# EasyEDA Pro project ProPrj_STM32音响_2025-06-08.epro, board Second Test
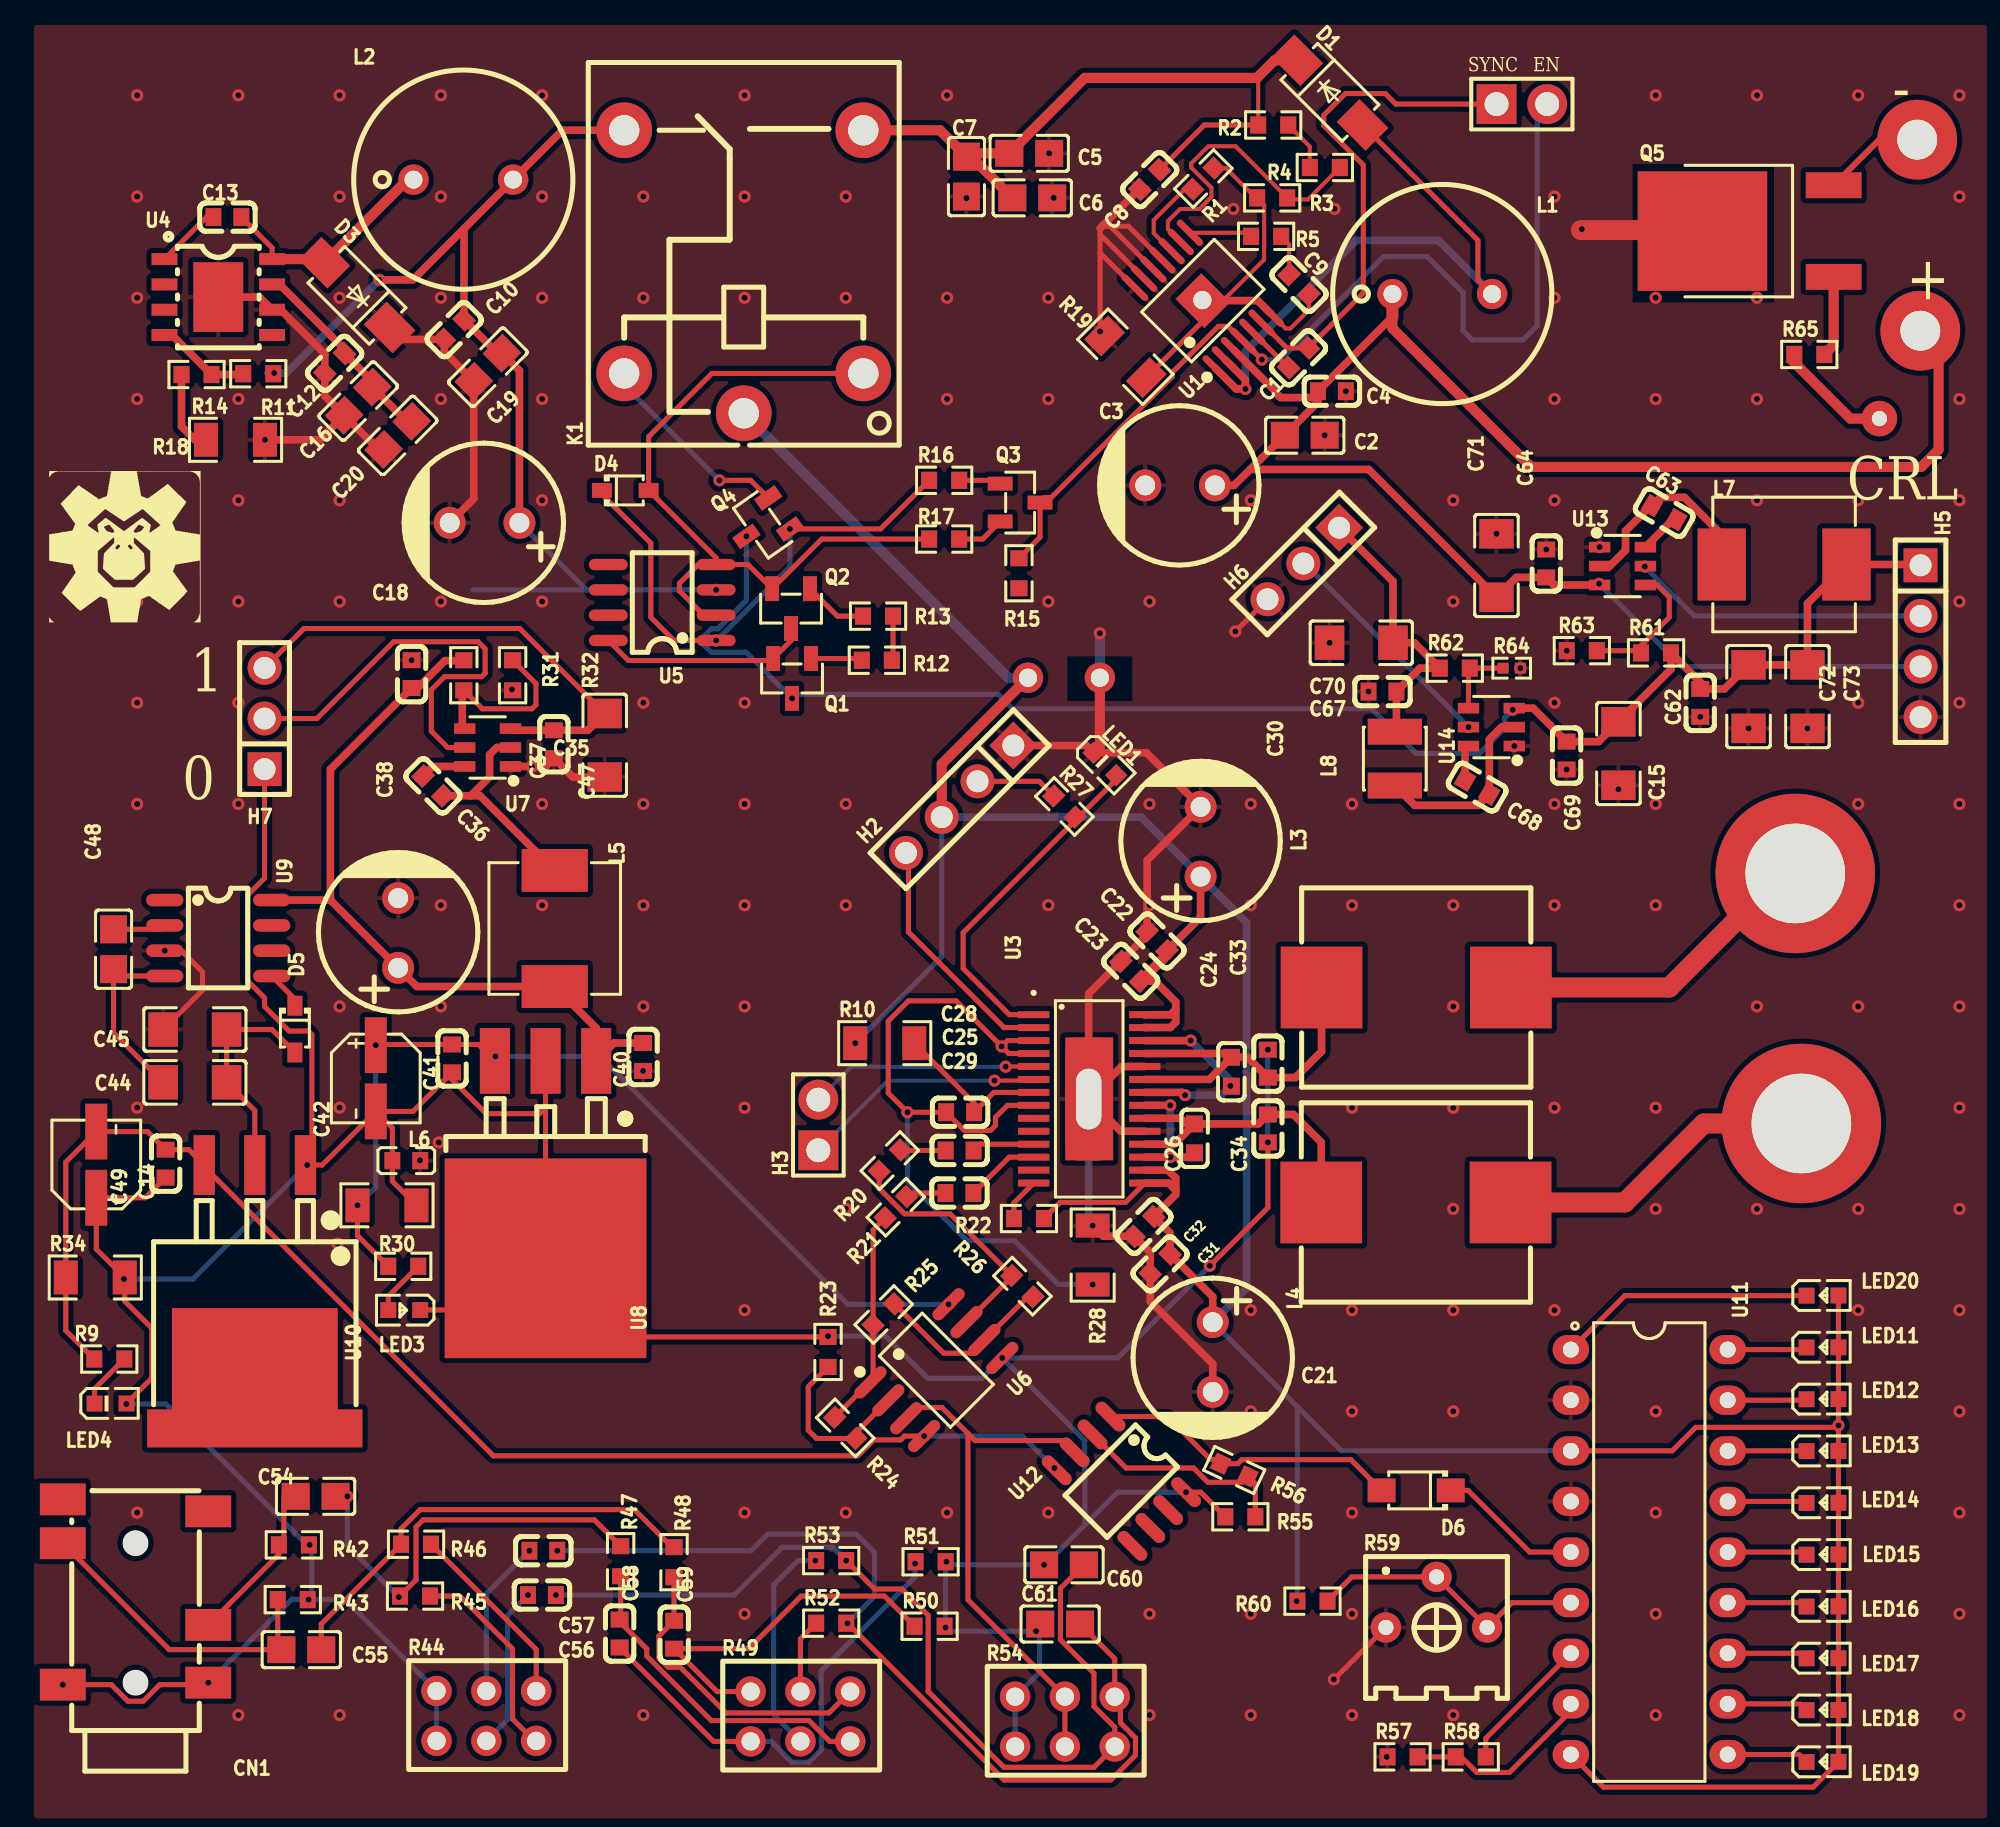
[diagram p17: board, top side]
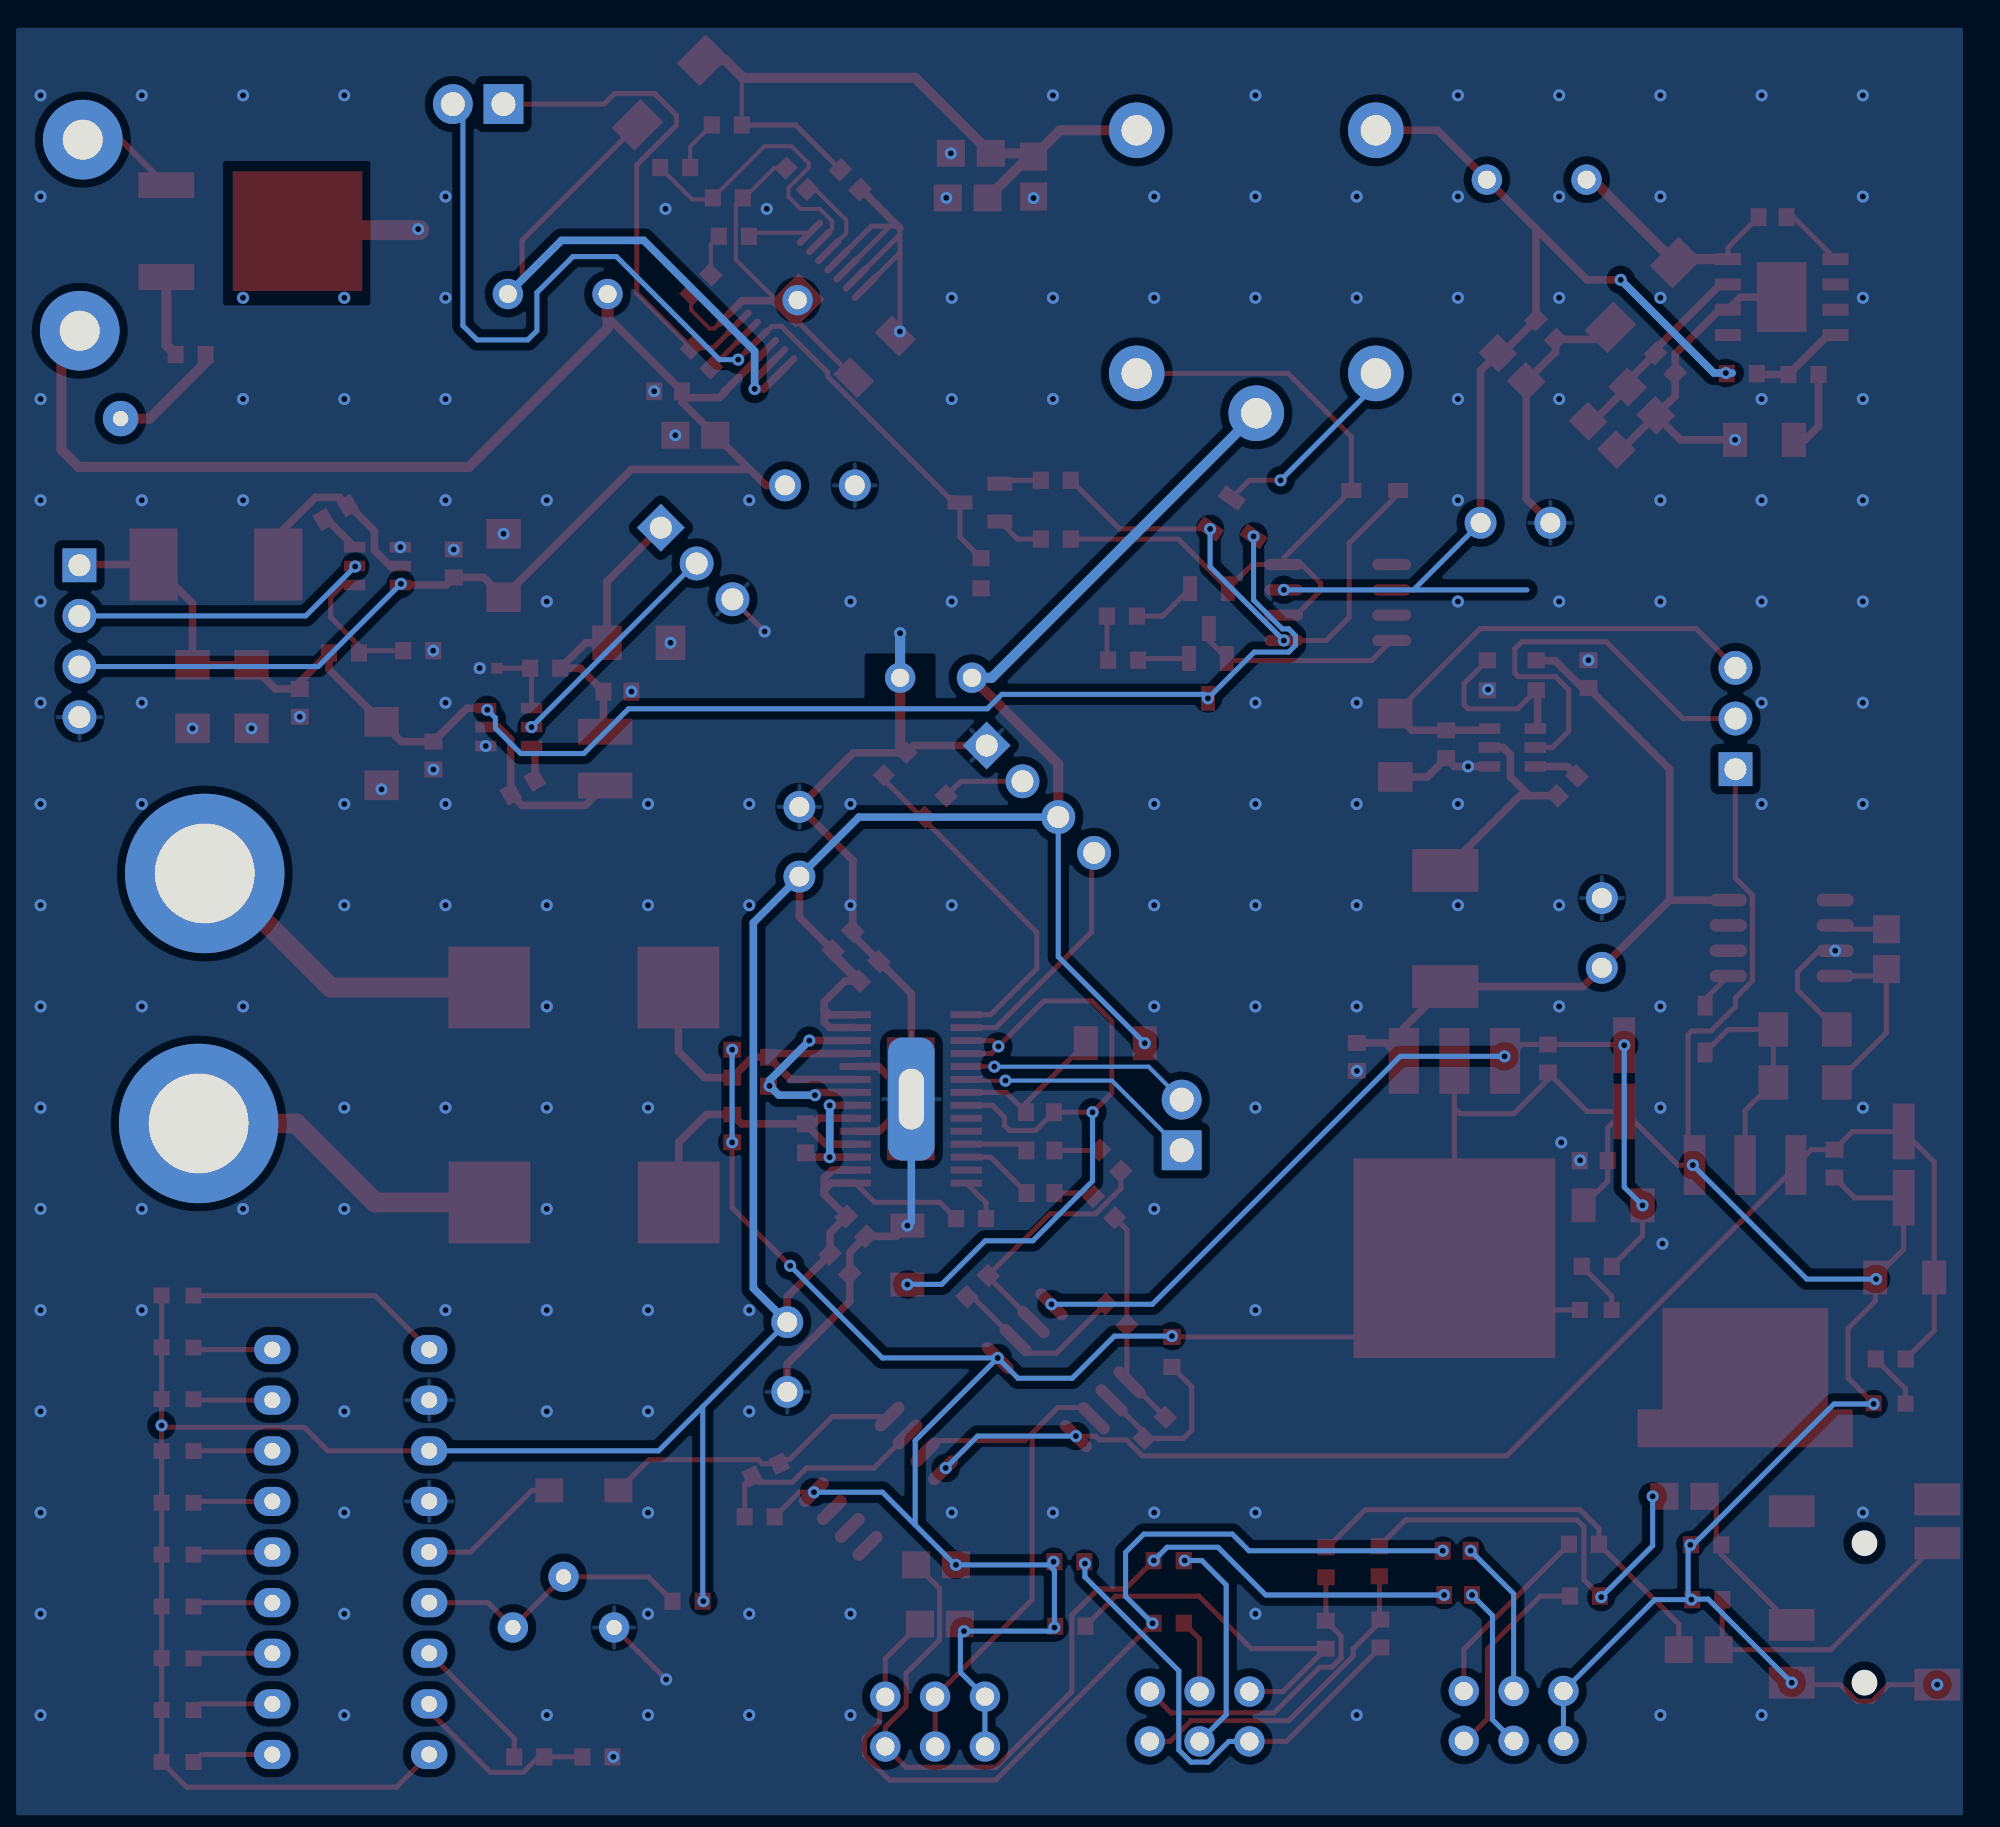
[diagram p18: board, bottom side, seen from below]

Outline 1.29 x 8.29 mm; copper layers: Top Layer, Bottom Layer. Coordinates in mm from the lower left corner of the outline.
Stack: Top Layer 0.035mm / Dielectric1 1.51mm FR4 er 4.5 / Bottom Layer 0.035mm

## Design rules (mm)
template: JLCPCB Capability(Two Layers Board)
spacing copperThickness1oz (default): track to track 0.102, other pairs 0.152 to 0.3
spacing copperThickness2oz: track to track 0.203, other pairs 0.152 to 0.3
track width copperThickness1oz (default): min 0.127, default 0.254, max 2.54
track width copperThickness2oz: min 0.203, default 0.254, max 2.54
differential pair differentialPair (default): width min 0.127, default 0.254, max 2.54; gap min 0.152, default 0.152
via viaSize (default): diameter min 0.5, default 0.61, max 10; hole min 0.3, default 0.305, max 6.3

## Placement (name value [footprint] x y rotation side)
C1  100nF  [C0603]  59 67.13 225 top
C2  10uF  [C0805]  59.32 63.24 180 top
C3  100uF  [CAP-TH_BD8.0-P3.50-D0.6-FD]  53.06 60.73 180 top
C4  100nF  [C0603]  60.68 65.45 180 top
C5  10uF  [C0805]  45.49 77.39 180 top
C6  10uF  [C0805]  45.64 75.16 180 top
C7  10uF  [C0805]  42.34 76.22 90 top
C8  100nF  [C0603]  51.54 76.07 45 top
C9  100nF  [C0603]  59.03 70.81 315 top
C10  10nF  [C0603]  16.64 68.54 225 top
C12  10nF  [C0603]  10.64 66.85 45 top
C13  10nF  [C0603]  5.26 74.19 180 top
C14  470nF  [C0603]  2.16 26.69 270 top
C15  22uF  [C1206]  75.06 47.27 270 top
C16  22uF  [C0805]  11.82 64.96 45 top
C18  100uF  [CAP-TH_BD8.0-P3.50-D0.6-FD]  18.16 58.85 180 top
C19  10uF  [C0805]  18.33 66.66 45 top
C20  22uF  [C0805]  13.8 63.24 45 top
C21  100uF  [CAP-TH_BD8.0-P3.50-D0.6-FD]  54.7 16.99 270 top
C22  100nF  [C0603]  51.91 37.87 135 top
C23  1nF  [C0603]  50.58 36.34 135 top
C24  470nF  [CAP-SMD_L1.6-W0.8-3]  55.64 31.3 270 top
C25  1uF  [C0603]  42.02 29.27 0 top
C26  470nF  [CAP-SMD_L1.6-W0.8-3]  53.79 27.96 270 top
C28  1uF  [C0603]  42 27.35 0 top
C29  1uF  [C0603]  41.99 25.22 0 top
C30  100uF  [CAP-TH_BD8.0-P3.50-D0.6-FD]  54.09 42.85 90 top
C31  100nF  [C0603]  52.06 21.66 225 top
C32  1nF  [C0603]  51.25 23.54 225 top
C33  1uF  [C0603]  57.47 31.71 270 top
C34  1uF  [C0603]  57.47 28.46 270 top
C35  10nF  [C0603]  14.5 51.26 270 top
C36  10nF  [C0603]  15.57 45.65 135 top
C37  10nF  [C0603]  21.64 47.74 90 top
C38  100uF  [CAP-TH_BD8.0-P3.50-D0.6-FD]  13.83 38.27 90 top
C40  470nF  [C0603]  26.12 32.05 90 top
C41  470nF  [C0603]  16.53 31.97 90 top
C42  10uF  [CAP-SMD_BD4.0-L4.3-W4.3-LS5.0-FD]  12.7 30.98 270 top
C44  10uF  [C1206]  3.63 30.77 180 top
C45  10uF  [C1206]  3.63 33.42 0 top
C47  10uF  [C1206]  24.19 47.69 90 top
C48  22uF  [C0805]  -0.45 37.45 90 top
C49  10uF  [CAP-SMD_BD4.0-L4.3-W4.3-LS5.0-FD]  -1.32 26.64 90 top
C54  2.2uF  [C0805]  9.68 10 180 top
C55  2.2uF  [C0805]  8.97 2.3 0 top
C56  10nF  [C0603]  21.04 5.05 0 top
C57  10nF  [C0603]  21.11 7.27 0 top
C58  10nF  [C0603]  24.94 3.11 270 top
C59  10nF  [C0603]  27.68 3.05 270 top
C60  470pF  [C0805]  47.24 6.56 180 top
C61  470pF  [C0805]  47.04 3.59 0 top
C62  10nF  [C0603]  79.16 49.81 90 top
C63  10nF  [C0603]  77.35 59.36 330 top
C64  10nF  [C0603]  71.44 56.81 270 top
C67  10nF  [C0603]  63.22 50.38 0 top
C68  10nF  [C0603]  67.97 45.59 150 top
C69  10nF  [C0603]  72.46 47.17 90 top
C70  22uF  [C1206]  62.15 52.83 180 top
C71  22uF  [C1206]  68.94 56.71 90 top
C72  22uF  [C1206]  81.58 50.13 270 top
C73  22uF  [C1206]  84.54 50.13 270 top
CN1  PJ-342  [AUDIO-SMD_PJ-342]  0.65 5.2 180 top
D1  SS54  [SMA_L4.3-W2.6-LS5.0-FD]  60.58 80.44 135 top
D3  SS54  [SMA_L4.3-W2.6-LS5.0-FD]  11.76 70.28 315 top
D4  1N5819WS  [SOD-323_L1.8-W1.3-LS2.5-RD]  25.22 60.47 0 top
D5  1N5819WS  [SOD-323_L1.8-W1.3-LS2.5-RD]  8.64 33.44 270 top
D6  1N4007W  [SOD-123FL_L2.7-W1.8-LS3.8-RD]  64.91 10.3 180 top
H2  PZ254V-11-04P  [HDR-TH_4P-P2.54-V-M]  42 44.98 225 top
H3  PZ254V-11-02P  [HDR-TH_2P-P2.54-V-M]  34.91 28.63 90 top
H4  PZ254V-11-02P  [HDR-TH_2P-P2.54-V-M]  70.21 79.86 0 top
H5  PZ254V-11-04P  [HDR-TH_4P-P2.54-V-M]  90.22 52.91 270 top
H6  PZ254V-11-03P  [HDR-TH_3P-P2.54-V-M]  59.25 56.81 225 top
H7  PZ254V-11-03P  [HDR-TH_3P-P2.54-V-M]  7.12 49.03 90 top
K1  SRD-05VDC-SL-C  [RELAY-TH_SRD-XXVDC-XL-C]  31.17 71.45 90 top
L1  YDPK0912-470K  [IND-TH_BD11.0-P5.00-D0.6]  66.22 70.33 0 top
L2  YDPK0912-470K  [IND-TH_BD11.0-P5.00-D0.6]  17.09 76.07 0 top
L3  15uH  [IND-SMD_L11.5-W10.0_FXL1040]  64.91 35.53 0 top
L4  15uH  [IND-SMD_L11.5-W10.0_FXL1040]  64.89 24.74 0 top
L5  22uH  [IND-SMD_L7.1-W6.6]  21.68 38.49 270 top
L6  BLM18AG601SN1D  [L0603]  14.23 26.84 0 top
L7  15uH  [IND-SMD_L7.0-W6.6_FXL0630]  83.37 56.76 180 top
L8  2.2uH  [IND-SMD_L3.0-W3.0_FNR30XXS]  63.84 47.02 270 top
LED1  XL-1608UGC-04  [LED0603-RD_GREEN]  49.29 46.75 315 top
LED3  XL-1608SURC-06  [LED0603-RD_RED]  14.13 19.35 180 top
LED4  XL-1608UGC-04  [LED0603-RD_GREEN]  -0.61 14.66 0 top
LED11  XL-1608SURC-06  [LED0603-RD_RED]  85.3 17.47 0 top
LED12  XL-1608SURC-06  [LED0603-RD_RED]  85.3 14.87 0 top
LED13  XL-1608SURC-06  [LED0603-RD_RED]  85.3 12.27 0 top
LED14  XL-1608SURC-06  [LED0603-RD_RED]  85.3 9.67 0 top
LED15  XL-1608SURC-06  [LED0603-RD_RED]  85.3 7.07 0 top
LED16  XL-1608SURC-06  [LED0603-RD_RED]  85.3 4.47 0 top
LED17  XL-1608SURC-06  [LED0603-RD_RED]  85.3 1.87 0 top
LED18  XL-1608SURC-06  [LED0603-RD_RED]  85.3 -0.73 0 top
LED19  XL-1608SURC-06  [LED0603-RD_RED]  85.3 -3.33 0 top
LED20  XL-1608SURC-06  [LED0603-RD_RED]  85.3 20.07 0 top
NOREF  -  [Pad_e339]  45.43 51.08 0 top
NOREF#2  -  [Pad_e138]  54.18 70.03 0 top
NOREF#3  -  [Pad_e517]  48.47 29.93 0 top
NOREF#4  -  [Pad_e850]  84.24 28.71 45 top
NOREF#5  -  [Pad_e1679]  88.15 64.08 45 top
NOREF#6  -  [Pad_e1580]  90.05 78.08 45 top
NOREF#7  -  [Pad_e340]  49.04 51.08 0 top
NOREF#8  -  [Pad_e1648]  90.2 68.49 45 top
NOREF#9  -  [Pad_e845]  83.93 41.25 45 top
Q1  MMBT3904  [SOT-23-3_L2.9-W1.3-P1.90-LS2.4-BR]  33.59 51.04 90 top
Q2  MMBT3906LT1G  [SOT-23-3_L2.9-W1.3-P1.90-LS2.4-BR]  33.54 54.55 90 top
Q3  2N7002KT1G  [SOT-23-3_L2.9-W1.3-P1.90-LS2.4-BR]  45.03 59.87 180 top
Q4  2N7002KT1G  [SOT-23-3_L2.9-W1.3-P1.90-LS2.4-BR]  32.12 58.75 35 top
Q5  AOD240  [TO-252-2_L6.6-W6.1-P4.60-LS10.0-BR-CW]  82.56 73.49 0 top
R1  100kΩ  [R0603]  54.23 76.12 45 top
R2  6.8kΩ  [R0603]  57.73 78.81 180 top
R3  10kΩ  [R0603]  57.68 75.16 180 top
R4  130kΩ  [R0603]  60.33 76.68 180 top
R5  2kΩ  [R0603]  57.38 73.23 0 top
R9  150Ω  [R0603]  -0.67 16.89 0 top
R10  10Ω  [R1206]  38.24 32.74 0 top
R11  10kΩ  [R0603]  6.81 66.33 0 top
R12  1kΩ  [R0603]  37.85 51.95 180 top
R13  1kΩ  [R0603]  37.91 54.17 180 top
R14  750Ω  [R0603]  3.71 66.29 180 top
R15  100kΩ  [R0603]  44.97 56.32 90 top
R16  100Ω  [R0603]  41.22 60.98 0 top
R17  2kΩ  [R0603]  41.22 58.03 180 top
R18  0Ω  [R1206]  5.66 63.01 180 top
R19  0Ω  [R1206]  50.32 67.18 315 top
R20  1kΩ  [R0603]  38.49 26.84 45 top
R21  1kΩ  [R0603]  38.8 24.51 45 top
R22  10kΩ  [R0603]  45.48 23.94 180 top
R23  1kΩ  [R0603]  35.4 17.24 270 top
R24  1kΩ  [R0603]  36.26 13.43 135 top
R25  1kΩ  [R0603]  38.19 19.12 45 top
R26  1kΩ  [R0603]  45.15 20.55 135 top
R27  1kΩ  [R0603]  47.26 44.61 315 top
R28  0Ω  [R1206]  48.67 22.1 270 top
R30  150Ω  [R0603]  14.08 21.54 0 top
R31  10kΩ  [R0603]  17.12 51.2 90 top
R32  750Ω  [R0603]  19.57 51.2 270 top
R33  0Ω  [R1206]  13.26 24.6 0 top
R34  0Ω  [R1206]  -1.37 20.98 0 top
R42  4.7kΩ  [R0603]  8.59 7.56 0 top
R43  4.7kΩ  [R0603]  8.54 4.81 0 top
R44  -  [DIP-6 For RK09L]  18.29 -1.04 0 top
R45  4.7kΩ  [R0603]  14.67 4.99 0 top
R46  4.7kΩ  [R0603]  14.72 7.59 0 top
R47  2kΩ  [R0603]  24.99 6.74 270 top
R48  2kΩ  [R0603]  27.67 6.69 270 top
R49  -  [DIP-6 For RK09L]  34.05 -1.07 0 top
R50  10kΩ  [R0603]  40.49 3.48 0 top
R51  10kΩ  [R0603]  40.54 6.72 0 top
R52  10kΩ  [R0603]  35.55 3.63 0 top
R53  10kΩ  [R0603]  35.55 6.77 0 top
R54  -  [DIP-6 For RK09L]  47.32 -1.33 0 top
R55  1kΩ  [R0603]  56.08 8.97 0 top
R56  10kΩ  [R0603]  55.78 11.32 155 top
R57  1kΩ  [R0603]  64.22 -3.08 0 top
R58  1kΩ  [R0603]  67.65 -3.08 0 top
R59  10kΩ  [RES-ADJ-TH_3362P]  65.93 4.69 0 top
R60  100kΩ  [R0603]  59.71 4.74 0 top
R61  100kΩ  [R0603]  76.94 52.32 0 top
R62  100kΩ  [R0603]  66.85 51.56 0 top
R63  13kΩ  [R0603]  73.22 52.43 180 top
R64  450kΩ  [R0402]  69.7 51.56 0 top
R65  1kΩ  [R0603]  84.64 67.3 0 top
U1  TPS55340PWPR  [HTSSOP-14_L5.0-W4.4-P0.65-LS6.4-BL-EP]  54.2 70 45 top
U3  TPA3110D2PWPR  [TSSOP-28_L9.7-W4.4-P0.65-LS6.4-BL-EP6.2]  48.5 29.94 270 top
U4  TPS5450DDAR  [ESOP-8_L4.9-W3.9-P1.27-LS6.0-TL-EP]  4.8 70.18 0 top
U5  LM358G-S08-R  [SOIC-8_L5.0-W4.0-P1.27-LS6.0-BL]  27.08 54.85 90 top
U6  NE5532DR  [SOIC-8_L4.9-W3.9-P1.27-LS6.0-BL]  40.83 16.33 315 top
U7  TPS54302DDCR  [SOT-23-6_L2.9-W1.6-P0.95-LS2.8-BL]  18.31 47.57 90 top
U8  LM7805S/TR  [TO-263-3_L8.6-W10.2-P2.54-LS14.4-BR]  21.22 26.9 90 top
U9  ICL7660M/TR  [SOP-8_L4.9-W3.9-P1.27-LS6.0-BL]  4.8 38.01 270 top
U10  LM7905S/TR  [TO-263-3L_L10.2-W8.6-P2.54-LS14.4-TL]  6.63 21.29 270 top
U11  LM3916N  [PDIP-18_L22.9-W6.4-P2.54-LS7.9-BL]  76.61 7.2 270 top
U12  NE5532M/TR  [SOP-8_L4.9-W3.9-P1.27-LS6.0-BL]  50.12 10.76 225 top
U13  TPS54302DDCR  [SOT-23-6_L2.9-W1.6-P0.95-LS2.8-BL]  75.26 56.68 270 top
U14  TPS54302DDCR  [SOT-23-6_L2.9-W1.6-P0.95-LS2.8-BL]  68.68 48.6 90 top

## Footprints (pads in the part's own frame, mm; a bottom-side part is the same pattern mirrored in y, then rotated)
AUDIO-SMD_PJ-342
  rect 2.3x1.6 smd: 2(-3.65,4.55) 3(3.65,4.65) 4(-3.65,1.65) 5(3.65,-2.45) 6(-3.65,-4.05) 7(3.65,-4.65)
C0603
  rect 0.8x0.9 smd: 1(-0.7,0) 2(0.7,0)
C0805
  rect 1.41x1.35 smd: 1(-1,0) 2(1,0)
C1206
  rect 1.485x1.728 smd: 1(-1.593,0) 2(1.593,0)
CAP-SMD_BD4.0-L4.3-W4.3-LS5.0-FD
  rect 2.8x1.1 smd: 1(-1.661,0) 2(1.661,0)
CAP-SMD_L1.6-W0.8-3
  rect 0.85x0.85 smd: 1(-0.725,0) 2(0.725,0)
CAP-TH_BD8.0-P3.50-D0.6-FD
  round 1.6 hole 1: 1(-1.75,0) 2(1.75,0)
DIP-6 For RK09L
  round 1.524 hole 0.914: 1(-2.54,1.27) 2(-0.04,1.27) 3(2.46,1.27) 4(-2.54,-1.23) 5(-0.04,-1.23) 6(2.46,-1.23)
ESOP-8_L4.9-W3.9-P1.27-LS6.0-TL-EP
  rect 1.3x0.6 smd: 1(-2.7,1.905) 2(-2.7,0.635) 3(-2.7,-0.635) 4(-2.7,-1.905) 5(2.7,-1.905) 6(2.7,-0.635) 7(2.7,0.635) 8(2.7,1.905)
  rect 2.5x3.5 smd: 9(0,0)
HDR-TH_2P-P2.54-V-M
  rect 2x2 hole 1.2: 1(-1.27,0)
  round 2 hole 1.2: 2(1.27,0)
HDR-TH_3P-P2.54-V-M
  rect 1.7x1.7 hole 1.1: 1(-2.54,0)
  round 1.7 hole 1.1: 2(0,0) 3(2.54,0)
HDR-TH_4P-P2.54-V-M
  rect 1.7x1.7 hole 1.1: 1(-3.81,0)
  round 1.7 hole 1.1: 2(-1.27,0) 3(1.27,0) 4(3.81,0)
HTSSOP-14_L5.0-W4.4-P0.65-LS6.4-BL-EP
  oval 0.343x1.732 smd: 1(-1.95,-2.866) 2(-1.3,-2.866) 3(-0.65,-2.866) 4(0,-2.866) 5(0.65,-2.866) 6(1.3,-2.866) 7(1.95,-2.866) 8(1.95,2.865) 9(1.3,2.865) 10(0.65,2.865) 11(0,2.865) 12(-0.65,2.865) 13(-1.3,2.865) 14(-1.95,2.865)
  rect 1.83x2.055 smd: 15(0,0)
IND-SMD_L3.0-W3.0_FNR30XXS
  rect 1.3x2.72 smd: 1(1.35,0) 2(-1.35,0)
IND-SMD_L7.0-W6.6_FXL0630
  rect 2.424x3.62 smd: 1(3.128,0) 2(-3.128,0)
IND-SMD_L7.1-W6.6
  rect 2.15x3.32 smd: 1(-2.913,0) 2(2.913,0)
IND-SMD_L11.5-W10.0_FXL1040
  rect 4.1x4.1 smd: 1(-4.75,0) 2(4.75,0)
IND-TH_BD11.0-P5.00-D0.6
  round 1.524 hole 0.9: 1(-2.5,0) 2(2.5,0)
L0603
  rect 0.8x0.864 smd: 1(-0.7,0) 2(0.7,0)
LED0603-RD_GREEN
  rect 0.8x0.8 smd: 1(-0.799,-0.004) 2(0.799,0.004)
LED0603-RD_RED
  rect 0.8x0.8 smd: 1(-0.799,-0.004) 2(0.799,0.004)
Pad_e138
  round 1.524 hole 0.914: 1(0,0)
Pad_e339
  round 1.524 hole 0.914: 1(0,0)
Pad_e340
  round 1.524 hole 0.914: 2(0,0)
Pad_e517
  rrect 2.337x6.17 hole 1.27x3.048: 1(0,0)
Pad_e845
  round 8 hole 5: 1(0,0)
Pad_e850
  round 8 hole 5: 1(0,0)
Pad_e1580
  round 4 hole 2: 1(0,0)
Pad_e1648
  round 4 hole 2: 1(0,0)
Pad_e1679
  round 1.778 hole 0.762: 1(0,0)
PDIP-18_L22.9-W6.4-P2.54-LS7.9-BL
  oval 1.462x1.827 hole 0.8: 1(-10.16,-3.935) 2(-7.62,-3.935) 3(-5.08,-3.935) 4(-2.54,-3.935) 5(0,-3.935) 6(2.54,-3.935) 7(5.08,-3.935) 8(7.62,-3.935) 9(10.16,-3.935) 10(10.16,3.935) 11(7.62,3.935) 12(5.08,3.935) 13(2.54,3.935) 14(0,3.935) 15(-2.54,3.935) 16(-5.08,3.935) 17(-7.62,3.935) 18(-10.16,3.935)
R0402
  rect 0.566x0.54 smd: 1(-0.433,0) 2(0.433,0)
R0603
  rect 0.806x0.864 smd: 1(-0.753,0) 2(0.753,0)
R1206
  rect 1.208x1.701 smd: 1(-1.479,0) 2(1.479,0)
RELAY-TH_SRD-XXVDC-XL-C
  round 2.794 hole 1.524: 1(-5.1,-6) 2(7.1,-6) 3(7.1,6) 4(-5.1,6) 5(-7.1,0)
RES-ADJ-TH_3362P
  round 1.524 hole 0.762: 1(-2.54,-1.27) 2(0,1.27) 3(2.54,-1.27)
SMA_L4.3-W2.6-LS5.0-FD
  rect 2.046x1.62 smd: 1(-2.304,-0.009) 2(2.304,0.009)
SOD-123FL_L2.7-W1.8-LS3.8-RD
  rect 1.4x1.2 smd: 1(-1.735,0) 2(1.735,0)
SOD-323_L1.8-W1.3-LS2.5-RD
  rect 1x0.75 smd: 1(-1.173,0) 2(1.173,0)
SOIC-8_L4.9-W3.9-P1.27-LS6.0-BL
  oval 0.588x2.045 smd: 1(-1.905,-2.772) 2(-0.635,-2.772) 3(0.635,-2.772) 4(1.905,-2.772) 5(1.905,2.772) 6(0.635,2.772) 7(-0.635,2.772) 8(-1.905,2.772)
SOIC-8_L5.0-W4.0-P1.27-LS6.0-BL
  oval 0.569x1.95 smd: 1(-1.905,-2.705) 2(-0.635,-2.705) 3(0.635,-2.705) 4(1.905,-2.705) 5(1.905,2.705) 6(0.635,2.705) 7(-0.635,2.705) 8(-1.905,2.705)
SOP-8_L4.9-W3.9-P1.27-LS6.0-BL
  oval 0.63x1.865 smd: 1(-1.905,-2.683) 2(-0.635,-2.683) 3(0.635,-2.683) 4(1.905,-2.683) 5(1.905,2.683) 6(0.635,2.683) 7(-0.635,2.683) 8(-1.905,2.683)
SOT-23-3_L2.9-W1.3-P1.90-LS2.4-BR
  rect 1.25x0.7 smd: 1(1,-0.95) 2(1,0.95) 3(-1,0)
SOT-23-6_L2.9-W1.6-P0.95-LS2.8-BL
  rect 0.532x1.072 smd: 1(-0.95,-1.149) 2(0,-1.149) 3(0.95,-1.149) 4(0.95,1.149) 5(0,1.149) 6(-0.95,1.149)
TO-252-2_L6.6-W6.1-P4.60-LS10.0-BR-CW
  rect 2.8x1.3 smd: 1(3.292,-2.3) 3(3.292,2.3)
  rect 6.5x6 smd: 2(-3.292,0)
TO-263-3_L8.6-W10.2-P2.54-LS14.4-BR
  rect 3.3x1.511 smd: 1(4.952,-2.54) 2(4.952,0) 3(4.952,2.54)
  rect 10.02x10.122 smd: 4(-4.952,0)
TO-263-3L_L10.2-W8.6-P2.54-LS14.4-TL
  rect 3x1.07 smd: 1(-5.338,2.54) 2(-5.338,0) 3(-5.338,-2.54)
  custom 6.99x10.8 smd: 4(5.338,0)
TSSOP-28_L9.7-W4.4-P0.65-LS6.4-BL-EP6.2
  rect 0.35x1.575 smd: 1(-4.225,-2.788) 2(-3.575,-2.788) 3(-2.925,-2.788) 4(-2.275,-2.788) 5(-1.625,-2.788) 6(-0.975,-2.788) 7(-0.325,-2.788) 8(0.325,-2.788) 9(0.975,-2.788) 10(1.625,-2.788) 11(2.275,-2.788) 12(2.925,-2.788) 13(3.575,-2.788) 14(4.225,-2.788) 15(4.225,2.788) 16(3.575,2.788) 17(2.925,2.788) 18(2.275,2.788) 19(1.625,2.788) 20(0.975,2.788) 21(0.325,2.788) 22(-0.325,2.788) 23(-0.975,2.788) 24(-1.625,2.788) 25(-2.275,2.788) 26(-2.925,2.788) 27(-3.575,2.788) 28(-4.225,2.788)
  rect 6.17x2.4 smd: 29(0,0)

## Nets
As in the schematic, except:
+18V: C21.1 C22.1 C23.1 C30.1 C31.1 C32.1 H2.3 K1.5 LED11.2 LED12.2 LED13.2 LED14.2 LED15.2 LED16.2 LED17.2 LED18.2 LED19.2 LED20.2 NOREF.1 R10.1 R22.1 R60.1 U3.15 U3.16 U3.27 U3.28 U11.3 U11.9
AGND_1: C9.2 NOREF#2.1 R1.2 R3.2 R14.2 R18.2 R19.2 U1.7 U1.15
BAT+: C2.2 C3.1 C4.2 C64.2 C71.1 H5.3 L1.1 NOREF#8.1 U1.3 U13.3
BAT-: NOREF#6.1 Q5.3
EP: C2.1 C3.2 C4.1 C5.1 C6.1 C7.1 C8.1 C10.2 C12.1 C15.2 C16.1 C18.2 C19.1 C20.1 C21.2 C22.2 C23.2 C30.2 C31.2 C32.2 C35.1 C37.1 C38.2 C40.1 C45.1 C47.1 C62.1 C64.1 C67.1 C69.1 C70.2 C71.2 C72.2 C73.2 D3.2 H2.1 H5.4 H6.3 L6.2 LED1.1 NOREF#3.1 NOREF#7.2 Q5.2 R18.1 R19.1 R28.1 R32.2 R57.1 R59.1 R63.2 R64.2 U1.11 U1.12 U1.13 U1.14 U3.19 U3.24 U3.29 U4.6 U4.9 U7.1 U9.3 U11.2 U11.4 U13.1 U14.1
PWM_IN: NOREF#5.1 R65.1
$2N3822: L4.2 NOREF#4.1
$2N3827: L3.2 NOREF#9.1

Pads without a net: CN1 6 7; U3 13; U4 2 3; U5 5 6 7; U9 1 6 7; U10 4; U12 5 6 7

## Via types
v1: diameter 0.61, hole 0.305, Top Layer to Bottom Layer, 248 vias

## Routing (per net, layer and track width the routed paths; a pad name or vN(x,y) marks a point on that pad's centre or on a via; arc(x,y) is an arc through that point)
+3.3V: length 14.5
  Top Layer w0.381: H6.1 63.75,55.9 C70.1 64.82,52.83 R62.1 65.09,51.56 C67.2 63.92,48.45 L8.2
+5V_A: length 79.5
  Top Layer w0.381: H5.1 90.18,56.76 L7.2 84.54,54.8 C73.1 C72.1 80.38,50.51 C62.2 79.16,50.86 R61.2 77.7,51.51 74.06,47.87 C69.2 70.78,49.55 U14.3
  Bottom Layer w0.254: v1(69.75,49.47) 69.34,49.06 69.34,48.55 68.07,47.27 64.91,47.27 62.66,49.52 44.66,49.52 43.93,50.24 33.79,50.24 v1(33.59,50.04) 31.27,52.36 29.54,52.36 29.2,52.7 29.2,53.19 29.54,53.53 29.86,53.53 31.3,54.97 v1(31.3,58.17)
+5V_B: length 46.3
  Top Layer w0.254: v1(11.79,24.6) 11.79,23.08 R30.1 ; v1(12.7,32.64) 12.74,32.67 C41.2 17.86,32.67 U8.3
  Bottom Layer w0.254: v1(41.44,19.64) 36.38,19.64 23.94,32.08 v1(18.71,32.08) ; v1(12.7,32.64) 12.7,25.52 v1(11.79,24.6)
+8.5V: length 38.8
  Top Layer w0.381: 17.04,51.93 16.17,51.93 14.8,50.56 C35.2 10.43,46.48 10.43,39.92 ; 10.43,39.92 U9.8 ; 10.43,39.92 C38.1 14.76,35.58 L5.2 23.76,33.5 U8.1 24.66,32.75 C40.2
+18V: length 193.5
  Top Layer w0.254: U3.15 50.32,24.75 47.04,24.75 R22.1 ; U11.9 74.31,-4.6 84.83,-4.6 LED19.2 LED18.2 LED17.2 LED16.2 LED15.2 LED14.2 LED13.2 v1(86.1,13.56) ; v1(86.1,13.56) LED12.2 LED11.2 LED20.2 ; v1(86.1,13.56) 86,13.46 78.93,13.46 77.76,12.28 U11.3
  Top Layer w0.381: 52.84,25.36 52.84,25.14 C32.1 52.55,23.22 C31.1 54.7,20.01 C21.1 ; 52.84,25.36 52.84,25.97 52.45,26.37 U3.16 ; 52.84,25.36 52.49,25.72 U3.15 ; U3.27 51.3,33.52 52.57,33.52 52.84,33.79 52.84,34.43 ; C23.1 51.8,35.85 52.84,34.81 52.84,34.43 ; C22.1 54.09,39.06 C30.1 ; U3.28 51.3,34.16 52.57,34.16 52.84,34.43
  Top Layer w0.508: NOREF.1 41.1,46.75 41.1,44.08 ; C22.1 52.4,37.17 C23.1
  Bottom Layer w0.254: v1(36.76,32.74) 41.1,37.08 41.1,44.08 ; U11.3 61.16,12.28 58.94,14.5 ; 58.94,14.5 C21.1 ; 58.94,14.5 58.94,4.69
  Bottom Layer w0.381: C21.1 56.4,20.44 56.4,38.79 C30.1 51.1,44.08 41.1,44.08
  Bottom Layer w0.508: NOREF.1 44.44,51.08 K1.5
  vias: v1(58.91,4.74)
+18V_1: length 35.8
  Top Layer w0.203: R2.2 56.98,81.12 56.92,81.18
  Top Layer w0.254: R2.2 54.28,78.81 C8.2
  Top Layer w0.508: K1.2 41.02,78.55 C7.2 ; D1.2 57.81,82.06 56.92,81.18 48.28,81.18 C5.2 42.51,77.39 C7.2 ; C6.2 42.58,77.22 C7.2
+18V_2: length 55.7
  Top Layer w0.381: K1.3 22.07,78.55 L2.2 17.13,73.61 ; 17.13,73.61 14.57,71.04 v1(12.88,71.04) ; 17.13,73.61 C10.1 18.8,67.37 ; C18.1 19.91,66.49 C19.2
  Bottom Layer w0.254: v1(29.78,55.48) 23.28,55.48 ; 23.28,55.48 17.59,55.48 ; 23.28,55.48 C18.1
  Bottom Layer w0.381: v1(12.88,71.04) 8.2,66.37 v1(7.6,66.37) 7.29,66.37
+24V: length 10.1
  Top Layer w0.381: 14.51,63.94 14.25,63.94 C16.2 12.53,65.95 11.13,67.35 11.13,67.55 7.87,70.81 U4.7
-5V: length 68.6
  Top Layer w0.254: v1(40.22,13.02) 39.23,13.02 39.04,12.83 37.69,12.83 36.89,12.03 18.6,12.03 4.09,26.54 U10.3 3.32,27.39 C14.1 1.25,28.3 C49.2 -2.85,26.77 R34.1 -2.85,18.32 R9.1
  Bottom Layer w0.254: v1(40.22,13.02) 45.15,13.02 v1(46.75,11.42)
-8.5V: length 11.3
  Top Layer w0.254: U10.2 6.63,29.36 C44.1 C45.2 7.49,33.42 D5.2
AGND: length 218.5
  Top Layer w0.254: R55.1 54.1,10.21 v1(53.36,10.21) ; v1(54.55,21.57) 57.47,24.48 v1(57.47,27.76) ; 35.4,18 25.17,18 U8.4 ; v1(4.3,0.65) 4.2,0.55 1.86,0.55 1.03,-0.28 0.26,-0.28 -0.57,0.55 v1(-3,0.55) ; C42.2 10.01,26.62 U10.1 9.5,26.94 9.5,33.17 9.32,33.35 8.35,33.35 7.12,34.58 7.12,35.01 6.27,35.86 6.27,40.16 7.12,41.02 H7.1 ; C42.2 14.57,29.31 C41.1 16.53,30.91 18.24,29.2 20.92,29.2 21.22,29.5 ; C42.2 13.53,28.48 13.53,25.81 R33.2 ; C14.2 1.14,24.98 C49.1 -1.32,22.41 R34.2 0.11,19.79 1.47,18.43 1.47,15.94 LED4.2 ; U8.4 18.63,19.35 LED3.1 ; U8.4 21.22,29.5 ; 21.22,29.5 U8.2
  Bottom Layer w0.254: v1(0.19,14.63) 2.18,14.63 9.5,7.31 9.5,5.02 9.32,4.84 8.49,4.84 v1(4.3,0.65) ; 48.28,8.56 48.28,12.8 v1(44.14,16.94) ; 48.28,8.56 46.29,6.57 ; 48.28,8.56 49.92,10.21 v1(53.36,10.21) ; v1(35.4,18.04) 38.28,18.04 40.4,15.92 43.12,15.92 v1(44.14,16.94) ; R54.4 R54.1 46.01,1.17 46.01,3.05 v1(45.83,3.23) 41.47,3.23 v1(41.29,3.41) 41.29,6.27 41.59,6.56 v1(46.24,6.56) ; v1(44.14,16.94) 49.93,16.94 v1(54.55,21.57) ; v1(0.07,20.9) 3.54,20.9 v1(9.26,26.62) ; R44.4 R44.1 11.17,4.81 v1(9.33,4.81) ; v1(57.47,32.41) v1(57.47,27.76)
  vias: v1(9.39,7.56) v1(41.34,6.72)
AGND_1: length 24.5
  Top Layer w0.203: R1.2 55.36,76.65 56.93,75.08 ; C9.2 59.52,69.53 58.6,68.6 58.36,68.6 U1.7 ; R3.2 57.28,74.8 57.28,72.69 57.28,72.68 57.28,72.06 55.22,70
  Top Layer w0.254: 51.36,66.13 54.2,68.98 U1.15
  Top Layer w0.381: U1.7 56.96,70 54.91,70 ; R14.2 2.95,63.69 3.63,63.01 4.19,63.01
AGND_2: length 37.8
  Top Layer w0.254: U3.3 44.4,32.87 v1(44.11,32.57) ; v1(44.11,32.57) 41.82,34.86 39.43,34.86 38.42,33.84 38.42,30.24 v1(39.38,29.27) C25.1 42.24,28.36 43.55,28.36 43.8,28.61 43.8,29.02 44.4,29.62 U3.8 ; v1(44.11,32.57) 44.46,32.22 U3.4
  Bottom Layer w0.254: 48.58,20.64 46.95,20.64 44.77,22.82 42.38,22.82 39.38,25.82 v1(39.38,29.27)
  vias: v1(48.67,20.63)
GND: length 37.1
  Top Layer w0.254: R17.2 35.08,58.03 Q2.2 31.38,56.75 U5.4 ; K1.1 29.57,66.35 26.39,63.17 D4.2 29.78,57.09 U5.4 ; U5.4 28.88,56.75 27.94,55.82 27.94,55.43 29.16,54.21 U5.2
VIN2: length 24.8
  Top Layer w0.254: C47.2 19.92,53.55 9.1,53.55 H7.3
  Top Layer w0.381: C47.2 23.35,48.44 C37.2 19.55,48.44 U7.3
BAT+: length 95.4
  Top Layer w0.381: C4.2 59.98,64.91 C2.2 ; C4.2 63.72,69.19 ; C4.2 59.66,65.13 58.11,65.13 57.84,65.4 57.84,65.45 U1.3 ; U13.3 71.82,55.73 C64.2 69.93,56.11 C71.1 62.53,61.53 56.57,61.53 ; 56.57,61.53 58.32,63.24 ; 56.57,61.53 55.77,60.73 C3.1
  Top Layer w0.508: NOREF#8.1 91.12,67.57 91.12,62.52 90.25,61.65 70.67,61.65 63.72,68.61 63.72,69.19
  Top Layer w0.6: L1.1 63.72,69.19
  Bottom Layer w0.254: H5.3 78.24,51.64 v1(74.09,55.79)
BAT-: length 5.1
  Top Layer w0.3: Q5.3 88.15,78.08 NOREF#6.1
CRL1: length 2.2
  Top Layer w0.254: R12.1 38.66,52.01 R13.1
DIVIDER_L: length 14.3
  Top Layer w0.254: R60.2 61.68,5.96 R59.2 R59.3 69.71,4.66 U11.6
EN1: length 14.9
  Bottom Layer w0.254: H5.2 78.86,54.18 v1(76.38,56.66)
EN2: length 11.7
  Bottom Layer w0.254: H6.2 59.32,56.81 v1(67.53,48.6)
EN3: length 21.2
  Top Layer w0.254: U7.5 16.31,47.57 15.49,48.39 15.49,50.47 16.15,51.13 18.02,51.13 18.19,51.3 18.19,52.53 17.83,52.88 13.6,52.88 9.75,49.03 H7.2
EN_55340: length 49.3
  Top Layer w0.254: v1(57.17,67.04) U1.4 55.98,68.23 55.95,68.23 55.47,68.71 54.98,68.71 52.67,66.4 52.67,66.19 46.6,60.12 46.29,60.12 Q3.3 46.03,58.13 R15.2
  Bottom Layer w0.254: H4.2 70.98,79.36 70.98,68.74 70.26,68.03 67.72,68.03 67.26,68.49 67.26,70.4 65.46,72.21 63.27,72.21 58.1,67.04 v1(57.17,67.04)
EP: length 133.8
  Top Layer w0.254: C45.1 4.01,35.4 4.01,36.31 2.94,37.38 v1(2.12,37.38) ; v1(55.83,53.4) H6.3 ; U1.11 50.47,73.73 49.55,73.73 ; 49.27,68.23 v1(49.05,68.45) 49.05,72.4 ; 49.05,73.32 49.05,72.4 ; 49.05,73.32 49.05,73.63 ; 49.05,73.32 51.26,71.11 ; 49.05,72.4 U1.14 ; 49.55,73.73 49.15,73.73 ; 49.55,73.73 51.72,71.57 ; v1(60.78,0.81) 60.78,0.81 R59.1
  Top Layer w0.381: C47.1 22.58,46.1 C37.1 21.22,46.62 v1(20.54,46.62) U7.1 ; U4.9 6.7,70.18 6.71,70.17 6.87,70.17 U4.6 7.92,69.54 10.14,67.32 10.14,65.22 C16.1 ; U3.29 50.13,31.57 U3.24 ; v1(48.67,23.58) 49.21,23.05 C32.2 51.56,22.23 C31.2 51.56,19.78 54.7,16.65 C21.2 ; H2.1 48.36,47.67 LED1.1 51.38,47.31 C30.2 51.41,41.92 C22.2 51.41,38.16 C23.2 48.47,35.22 NOREF#3.1 50.09,28.32 U3.19 ; 13.4,68.66 14,68.05 C10.2 16.14,67.43 C19.1 17.62,60.06 C18.2 ; C20.1 12.83,62.53 C16.1 ; v1(7.14,63.01) 9.88,63.01 C16.1 ; 49.05,73.63 49.15,73.73 51.01,75.6 51.34,75.6
  Top Layer w0.508: LED1.1 49.04,47.63 NOREF#7.2
  Top Layer w1: Q5.2 79.22,73.54 73.17,73.54
  Bottom Layer w0.381: 48.68,23.58 48.47,23.79 NOREF#3.1
  Bottom Layer w0.508: NOREF#7.2 v1(49.04,53.31)
  vias: v1(0.73,80.3) v1(0.73,75.22) v1(0.73,70.14) v1(0.73,65.06) v1(0.73,59.98) v1(0.73,54.9) v1(0.73,49.82) v1(0.73,44.74) v1(0.73,29.5) v1(0.73,9.18) v1(5.81,80.3) v1(5.81,65.06) v1(5.81,59.98) v1(5.81,54.9) v1(5.81,49.82) v1(5.81,44.74) v1(5.81,-0.98) v1(10.78,22.68) v1(10.89,80.3) v1(10.89,75.22) v1(10.89,70.14) v1(10.89,59.98) v1(10.89,54.9) v1(10.89,34.58) v1(10.89,29.5) v1(10.89,-0.98) v1(14.5,51.96) v1(14.92,26.86) v1(15.86,27.76) v1(15.97,80.3) v1(15.97,75.22) v1(15.97,70.14) v1(15.97,65.06) v1(15.97,54.9) v1(15.97,39.66) v1(15.97,34.58) v1(19.54,50.49) v1(21.05,80.3) v1(21.05,75.22) v1(21.05,70.14) v1(21.05,65.06) v1(21.05,59.98) v1(21.05,54.9) v1(21.05,44.74) v1(21.05,39.66) v1(26.13,75.22) v1(26.13,70.14) v1(26.13,49.82) v1(26.13,44.74) v1(26.13,39.66) v1(26.13,34.58) v1(26.12,31.35) v1(26.13,-0.98) v1(31.21,80.3) v1(31.21,75.22) v1(31.21,70.14) v1(31.21,49.82) v1(31.21,44.74) v1(31.21,39.66) v1(31.21,34.58) v1(31.21,29.5) v1(31.21,19.34) v1(31.21,9.18) v1(31.21,4.1) v1(36.29,75.22) v1(36.29,70.14) v1(36.29,44.74) v1(36.29,39.66) v1(36.29,34.58) v1(36.29,24.42) v1(36.29,9.18) v1(41.37,80.3) v1(41.37,70.14) v1(41.37,65.06) v1(41.37,9.18) v1(42.34,75.15) v1(46.45,70.14) v1(46.45,65.06) v1(46.45,54.9) v1(46.45,39.66) v1(46.45,9.18) v1(46.49,77.39) v1(46.72,75.16) v1(51.53,54.9) v1(51.53,44.74) v1(51.53,39.66) v1(51.53,4.1) v1(51.53,-0.98) v1(55.73,74.6) v1(56.61,59.98) v1(56.61,44.74) v1(56.61,39.66) v1(56.61,19.34) v1(56.61,14.26) v1(56.61,4.1) v1(56.61,-0.98) v1(60.32,63.24) v1(60.56,52.83) v1(60.81,74.6) v1(61.38,65.45) v1(61.69,44.74) v1(61.69,39.66) v1(61.69,29.5) v1(61.69,19.34) v1(61.69,14.26) v1(61.69,9.18) v1(61.69,4.1) v1(61.69,-0.98) v1(62.52,50.38) v1(63.43,-3.08) v1(66.77,59.98) v1(66.77,54.9) v1(66.77,39.66) v1(66.77,34.58) v1(66.77,29.5) v1(66.77,24.42) v1(66.77,19.34) v1(66.77,14.26) v1(66.77,-0.98) v1(68.94,58.3) v1(69.83,47.65) v1(70.13,51.56) v1(71.44,57.51) v1(71.85,75.22) v1(71.85,70.14) v1(71.85,65.06) v1(71.85,59.98) v1(71.85,49.82) v1(71.85,44.74) v1(71.85,39.66) v1(71.85,29.5) v1(71.85,19.34) v1(72.47,52.43) v1(72.46,46.47) v1(73.22,73.59) v1(74.11,57.63) v1(75.06,45.48) v1(76.93,80.3) v1(76.93,70.14) v1(76.93,65.06) v1(76.93,44.74) v1(76.93,39.66) v1(76.93,29.5) v1(76.93,24.42) v1(76.93,14.26) v1(76.93,9.18) v1(76.93,4.1) v1(76.93,-0.98) v1(79.16,49.11) v1(81.58,48.54) v1(82.01,80.3) v1(82.01,70.14) v1(82.01,65.06) v1(82.01,59.98) v1(82.01,34.58) v1(82.01,24.42) v1(84.54,48.54) v1(87.09,80.3) v1(87.09,59.98) v1(87.09,49.82) v1(87.09,44.74) v1(87.09,34.58) v1(87.09,24.42) v1(87.09,19.34) v1(92.17,80.3) v1(92.17,75.22) v1(92.17,65.06) v1(92.17,59.98) v1(92.17,54.9) v1(92.17,49.82) v1(92.17,44.74) v1(92.17,39.66) v1(92.17,34.58) v1(92.17,29.5) v1(92.17,24.42) v1(92.17,19.34) v1(92.17,14.26) v1(92.17,9.18) v1(92.17,4.1) v1(92.17,-0.98)
FAULT#: length 12.3
  Top Layer w0.254: 39.31,42.29 39.43,42.16 39.43,38.31 44.23,33.52 U3.2
GAIN_0: length 11.5
  Top Layer w0.203: v1(44.31,31.56) 44.32,31.57 U3.5
  Bottom Layer w0.203: H3.2 36.57,31.56 v1(44.31,31.56)
GAIN_1: length 12.3
  Top Layer w0.203: v1(43.75,30.86) 45.66,30.86 U3.6
  Bottom Layer w0.203: v1(43.75,30.86) 38.41,30.86 H3.1
IN+: length 11
  Top Layer w0.254: R24.2 37.48,15.72 ; R21.1 37.66,23.37 R25.1 37.66,15.85 37.52,15.72
IN-: length 12.5
  Top Layer w0.254: R26.2 41.52,24.17 39.24,24.17 37.96,25.45 R20.1 ; U6.7 44.62,21.01
INL+_PRE: length 27.3
  Top Layer w0.254: U12.3 47.18,12.8 42.77,12.8 42.42,13.15 ; R54.5 R54.2 42.42,4.81 42.42,13.15 ; 39.32,13.92 39.85,14.45 41.11,14.45 42.42,13.15
L+: length 8
  Top Layer w0.254: 4.3,3.55 7.84,7.09 R42.1 8.09,7.81 8.09,10
PWM_IN: length 5.6
  Top Layer w0.508: NOREF#5.1 86.69,64.08 83.78,66.99
R+: length 15.8
  Top Layer w0.254: CN1.5 2.34,2.3 C55.1 7.78,2.49 R43.1
SD#: length 17.3
  Top Layer w0.254: 49.7,46.12 49.7,45.8 42.18,38.28 42.18,36.49 44.49,34.17 U3.1
SYNC: length 25.9
  Top Layer w0.254: 68.94,79.86 63.89,79.86 63.36,80.39 61.36,80.39 60.27,79.3 60.27,78.79 62.26,76.8 62.26,70.38 C1.1 58.42,67.62 U1.6
VU_L: length 15.4
  Top Layer w0.254: 55.25,11.85 54.58,11.85 52.43,14 U12.1 ; 55.1,11.64 55.96,11.64 56.16,11.84 61.63,11.84 D6.2
$1N1243: length 4.8
  Top Layer w0.203: U1.10 51.74,73.38 51.74,74.04 53.29,75.59 53.95,75.59
$1N1251: length 2.6
  Top Layer w0.254: 56.69,68.43 58.49,66.63 C1.2
$1N1256: length 32.7
  Top Layer w0.254: 62.21,78.82 68.01,73.02 68.01,71.04 L1.2
  Top Layer w0.381: 54.85,66.59 55.88,65.57 v1(56.34,65.57) 56.34,66.03 U1.2
  Bottom Layer w0.381: L1.2 66.03,73.02 61.9,73.02 56.34,67.46 v1(56.34,65.57)
$1N1257: length 2.6
  Top Layer w0.203: R4.2 59.57,77.73 R2.1
$1N1259: length 15.6
  Top Layer w0.203: R3.1 55.85,77.75 54.48,77.75 53.62,76.88 53.62,76.68 54.64,75.66 54.64,75.21 54.03,74.6 53.06,74.6 52.45,73.99 52.45,73.59 U1.9 ; 58.44,75.08 59.47,75.08 R4.1
$1N1260: length 3.1
  Top Layer w0.203: R5.1 56.45,73.4 53.56,73.4
$1N1261: length 2.1
  Top Layer w0.203: C9.1 58.53,72.82 R5.2
$1N1268: length 3.3
  Top Layer w0.254: C13.2 4.21,74.19 U4.1
$1N1269: length 11.6
  Top Layer w0.254: U4.8 7.5,72.65 C13.1
  Top Layer w0.508: L2.1 14.29,76.07 D3.1 9.94,72.08 U4.8
$1N1273: length 4.8
  Top Layer w0.381: R11.1 6.01,66.29 R14.1 2.48,68.27 U4.4
$1N2047: length 10.6
  Top Layer w0.254: U5.8 25.38,51.94 32.54,51.94 Q1.2 33.54,52.94 Q2.3
$1N2049: length 2.4
  Top Layer w0.254: 41.98,58.03 43.15,58.03 Q3.2
$1N2050: length 26.3
  Top Layer w0.254: R16.1 38.03,58.54 v1(33.48,58.54) ; 24.05,60.47 24.05,60.28 26.5,57.83 26.5,54.11 27.67,52.94 v1(29.78,52.94)
  Bottom Layer w0.254: v1(33.48,58.54) 33.48,56.65 v1(29.78,52.94)
$1N2051: length 2.1
  Top Layer w0.254: R16.2 43.87,60.98 Q3.1
$1N2061: length 3.2
  Top Layer w0.254: Q2.1 35.87,54.17 R13.2
$1N2062: length 2.6
  Top Layer w0.254: Q1.1 37.01,52.04 R12.2
$1N4412: length 10.2
  Top Layer w0.254: Q4.2 31.51,60.98 v1(29.95,60.98)
  Bottom Layer w0.254: v1(29.95,60.98) 25.17,65.76 K1.4
$1N7340: length 4.1
  Top Layer w0.508: Q5.1 85.86,67.77 R65.2
$2N1692: length 15.7
  Top Layer w0.381: U3.20 53.1,28.97 53.38,28.69 C26.1 ; L4.1 60.14,27.76 58.75,29.16 C34.1 56.99,28.69 C26.1 ; U3.18 52.77,27.67 C26.1
$2N1693: length 17.9
  Top Layer w0.381: C24.1 56.45,32.03 57.47,31.01 58.85,31.01 60.16,32.32 L3.1 ; C24.1 54.53,30.92 U3.23 ; C24.1 55.45,32.22 U3.25
$2N1694: length 2
  Top Layer w0.254: 39.25,25.22 C29.1
$2N1695: length 3.1
  Top Layer w0.254: C28.2 43.02,27.67 U3.11
$2N1697: length 3.8
  Top Layer w0.254: U3.12 44.49,27.02 C29.2
$2N1698: length 2.2
  Top Layer w0.254: R22.2 44.72,24.73 U3.14
$2N1709: length 10
  Top Layer w0.381: v1(53.31,30.13) 53.17,30.27 U3.22 ; U3.26 v1(53.59,32.87)
  Bottom Layer w0.381: v1(53.59,32.87) 55.59,30.88 v1(55.59,30.59) 55.12,30.13 v1(53.31,30.13)
$2N1714: length 6.5
  Top Layer w0.381: C26.2 53.57,27.02 v1(52.57,27.02) U3.17 ; U3.21 52.57,29.62 v1(52.57,29.62)
  Bottom Layer w0.381: 52.59,27.04 52.57,27.06 v1(52.57,29.62)
$2N1723: length 8.1
  Top Layer w0.254: U3.7 43.72,30.27 C25.2 42.72,29.73 39.72,32.74
$2N1725: length 2
  Top Layer w0.254: C28.1 39.36,27.35 39.32,27.39
$2N3339: length 8.7
  Top Layer w0.254: R23.2 34.4,15.5 34.4,13.32 34.82,12.9 R24.1 36.79,13.19 U6.2
$2N3344: length 9.2
  Top Layer w0.254: R25.2 41.2,17.18 42.58,17.18 U6.6 45.41,20.01 R26.1
$2N3625: length 4.1
  Top Layer w0.254: H2.2 45.99,45.88 46.72,45.15
$2N3822: length 16.2
  Top Layer w1: NOREF#4.1 79.34,28.71 75.38,24.74 L4.2
$2N3827: length 16.6
  Top Layer w1: NOREF#9.1 83.33,41.25 77.61,35.53 L3.2
$3N912: length 8.8
  Top Layer w0.254: 19.57,51.95 20.74,50.78 20.74,49.72 20.54,49.52 18.05,49.52 R31.1
  Top Layer w0.381: R31.1 17.04,50.37 17.04,48.65 U7.4
$3N913: length 10.8
  Top Layer w0.381: 17.47,45.15 C36.1 ; 17.47,45.15 17.94,45.15 L5.1 ; 17.47,45.15 18.42,46.1 18.42,47.22 18.77,47.57 U7.2
$3N916: length 2.3
  Top Layer w0.381: C36.2 15.56,46.62 U7.6
$3N920: length 2.8
  Top Layer w0.254: R30.2 13.33,20.04 LED3.2
$3N1793: length 2.7
  Top Layer w0.254: U9.2 1.92,38.45 C48.2
$3N1802: length 9.4
  Top Layer w0.254: U9.4 -0.11,36.11 C48.1 -0.45,33.26 C44.2
$3N1996: length 2
  Top Layer w0.254: D5.1 8.64,34.95 U9.5
$3N3049: length 2.9
  Top Layer w0.254: R9.2 -1.41,15.4 LED4.1
$5N981: length 10.4
  Top Layer w0.254: 15.43,4.99 16.92,4.99 19.57,2.34 19.57,-1.18 20.66,-2.27 R44.6
$5N1180: length 8.2
  Bottom Layer w0.254: v1(20.34,5.05) 19.31,4.02 19.31,-1.21 R44.5
$5N1185: length 7.9
  Bottom Layer w0.254: v1(20.41,7.27) 18.25,5.11 R44.2
$5N1191: length 21
  Top Layer w0.254: 24.99,7.5 23.67,8.82 15.08,8.82 14.72,8.46 14.72,5.81 v1(13.86,4.94)
  Bottom Layer w0.254: v1(11.28,10) 11.28,7.52 v1(13.86,4.94)
$5N1196: length 22.6
  Top Layer w0.254: R48.1 27.57,7.45 25.69,9.33 14.93,9.33 13.97,8.37 R46.1 9.97,3.59 C55.2
$5N1448: length 15.6
  Top Layer w0.254: R48.2 27.67,3.76 C59.1 26.91,2.99 26.91,1.88 26.95,1.85 26.95,1.84 27.11,1.68 27.12,1.68 27.37,1.42 27.98,1.42 30.28,-0.87 35.44,-0.87 R49.3
$5N1622: length 3.8
  Top Layer w0.254: R52.1 34.01,2.84 R49.2
$5N1741: length 11
  Bottom Layer w0.254: 34.77,6.78 33.9,6.78 32.68,5.55 32.68,-0.96 R49.5
  vias: v1(34.76,6.77)
$5N1768: length 47
  Top Layer w0.254: C60.1 47.06,5.38 47.06,2.8 48.74,1.12 48.74,-0.55 49.78,-1.59 R54.6 48.74,-3.6 44.22,-3.6 40.42,0.21 40.42,4.03 39.1,5.35 37.73,5.35 v1(36.31,6.77)
  Bottom Layer w0.254: v1(21.74,5.05) 30.69,5.05 33.08,7.44 35.64,7.44 v1(36.31,6.77)
$5N2402: length 46.7
  Top Layer w0.254: v1(36.37,3.63) 44.24,-4.24 49.58,-4.24 50.82,-3 50.82,-2.13 50.07,-1.37 50.07,-0.34 R54.3 49.78,1.85 C61.2
  Bottom Layer w0.254: v1(21.81,7.27) 31.53,7.27 32.37,8.1 36.81,8.1 37.72,7.19 37.72,4.98 v1(36.37,3.63)
$5N2454: length 9.6
  Top Layer w0.254: R44.3 20.75,2.32 R46.2
$5N2502: length 18.5
  Top Layer w0.254: R49.1 29.83,0.2 C59.2 31.41,2.35 34.05,4.99 38.22,4.99 R50.1
$5N2537: length 24.1
  Top Layer w0.254: C58.2 29.65,-2.3 R49.4
  Bottom Layer w0.254: R49.4 32.54,-2.3 33.58,-3.34 34.44,-3.34 35.05,-2.73 35.05,1.24 39.76,5.95 v1(39.76,6.62)
$5N2546: length 16.6
  Top Layer w0.254: R47.2 24.99,3.86 C58.1 24.94,3.7 26.3,2.34 26.3,1.98 29.54,-1.26 34.44,-1.26 35.48,-2.3 R49.6
$6N885: length 12.8
  Top Layer w0.254: 84.34,20.07 75.38,20.07 U11.1
$6N891: length 3.8
  Top Layer w0.254: U11.15 84.27,9.74 ; 84.42,9.74 LED14.1
$6N892: length 3.9
  Top Layer w0.254: U11.14 84.21,7.2 ; 84.36,7.2 LED15.1
$6N893: length 3.8
  Top Layer w0.254: U11.17 84.3,14.82 ; 84.45,14.82 LED12.1
$6N894: length 3.8
  Top Layer w0.254: U11.16 84.33,12.28 ; 84.48,12.28 LED13.1
$6N895: length 3.8
  Top Layer w0.254: 84.39,17.36 LED11.1 ; U11.18 84.24,17.36
$6N896: length 3.9
  Top Layer w0.254: U11.13 84.15,4.66 ; 84.3,4.66 LED16.1
$6N897: length 3.9
  Top Layer w0.254: 84.24,2.12 LED17.1 ; U11.12 84.09,2.12
$6N898: length 4
  Top Layer w0.254: U11.10 83.97,-2.96 ; 84.12,-2.96 LED19.1
$6N899: length 3.9
  Top Layer w0.254: 84.18,-0.42 LED18.1 ; U11.11 84.03,-0.42
$6N900: length 11.1
  Top Layer w0.254: R55.2 56.84,10.62 R56.1 56.17,10.7 54.45,10.7 53.74,11.42 50.35,11.42 48.67,13.1
$6N910: length 9.7
  Top Layer w0.254: R57.2 R58.1 67.17,-3.08 67.95,-3.86 69.59,-3.86 72.67,-0.78 U11.8
$6N911: length 7
  Top Layer w0.254: R58.2 68.4,-2.15 U11.7
$6N961: length 7.3
  Top Layer w0.254: D6.1 67.51,10.3 70.6,7.2 U11.5
$7N1047: length 10.4
  Top Layer w0.381: U13.2 74.62,56.68 75.41,57.47 75.41,58.44 76.68,59.71 76.75,59.71 77.16,60.12 78.37,60.12 80.24,58.25 L7.1
$7N1050: length 2.1
  Top Layer w0.381: U13.6 77.79,59.01 C63.2
$7N1059: length 7.1
  Top Layer w0.254: U13.4 77,55.73 77.61,55.13 77.61,54.11 76.19,52.69 R61.1 76.08,52.43 R63.1
$7N1060: length 9.6
  Top Layer w0.381: L8.1 64.83,44.67 68.01,44.67 C68.1 68.58,45.25 68.58,47.99 69.19,48.6 U14.2
$7N1063: length 1.8
  Top Layer w0.381: U14.6 67.36,47.48 C68.2
$7N1069: length 3.7
  Top Layer w0.254: R64.1 R62.2 67.53,51.49 U14.4

## Copper pours and planes (outline as drawn; the poured copper is in the pictures)
EP on Top Layer: -4.45,83.84 93.55,83.84 93.55,-6.16 -4.45,-6.16
EP on Bottom Layer: -4.45,83.84 93.55,83.84 93.55,-6.16 -4.45,-6.16

## Text on the board
Top Silkscreen Layer: SYNC | EN | 0 | 1 | CRL | - | +
